# EAGLE schematic MRCS-IOX32 (EAGLE 7.3.0)
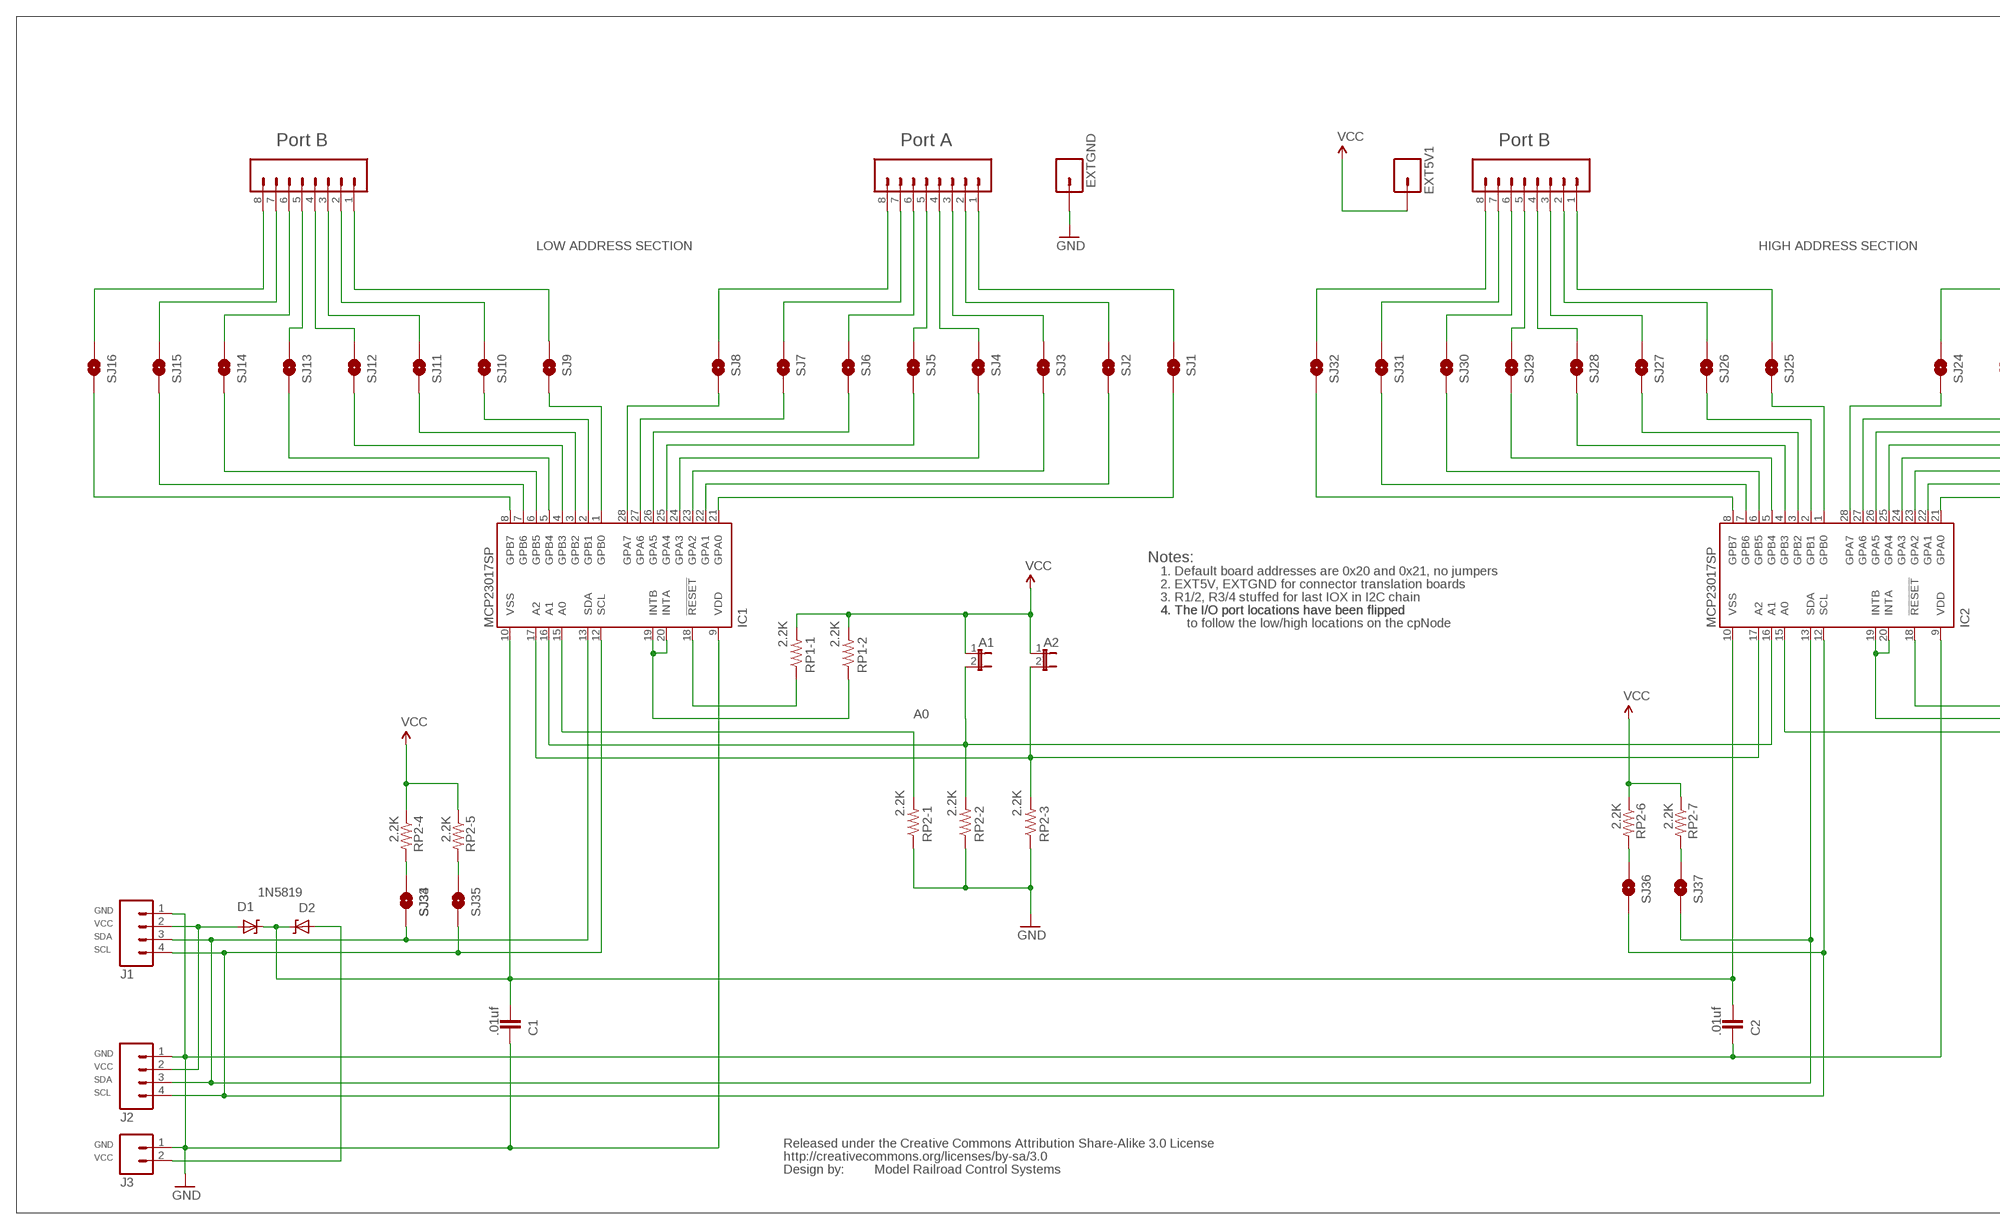
[diagram p0: schematic, sheet 1, part 1 of 2]
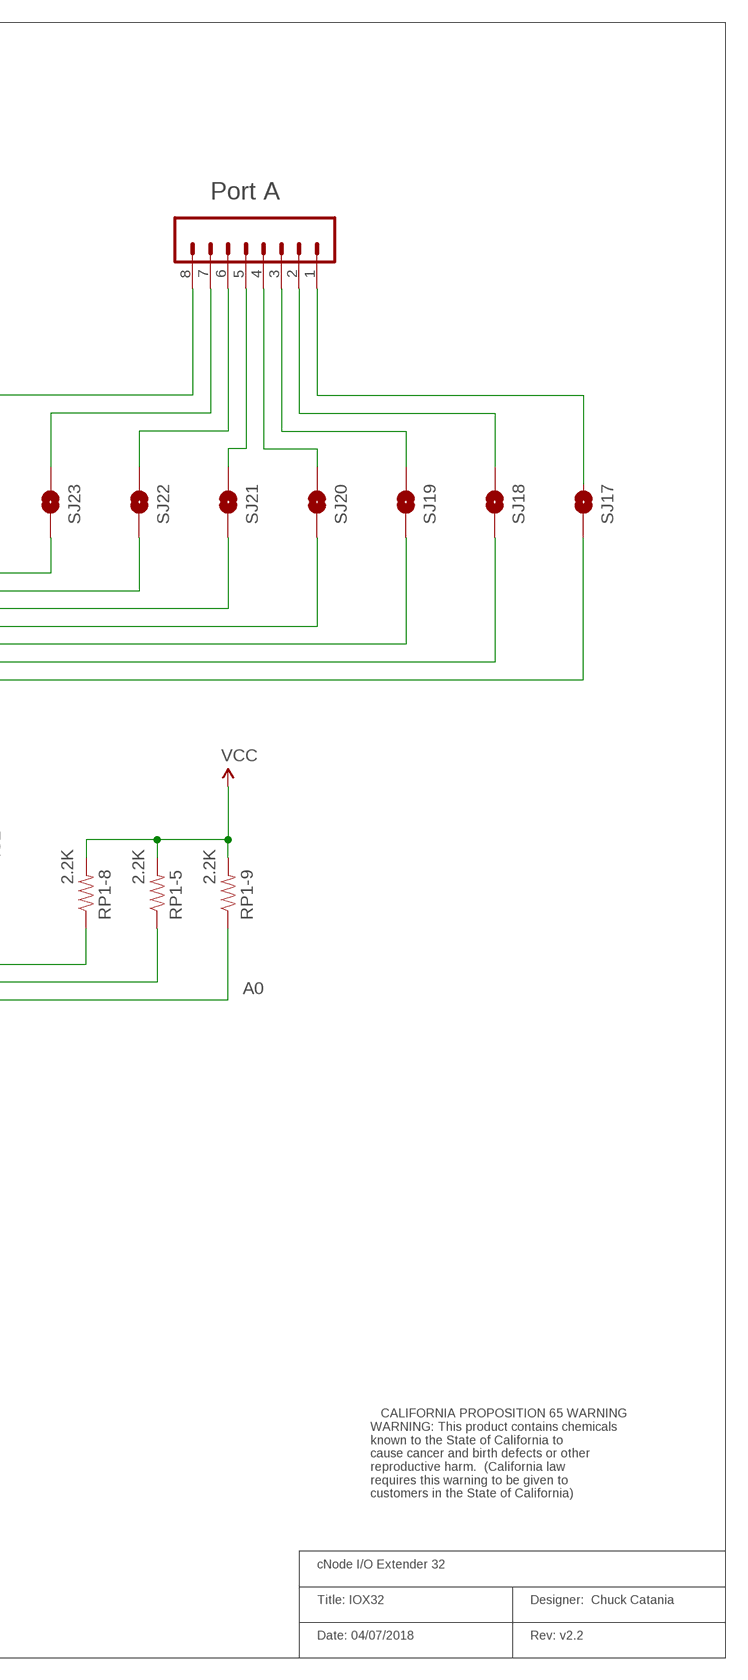
[diagram p1: schematic, sheet 1, part 2 of 2]

## Parts
A1  JUMPER-2PTH  [1X02]
A2  JUMPER-2PTH  [1X02]
C1  .01uf  CAP_  [AXIAL-5MM]
C2  .01uf  CAP_  [AXIAL-5MM]
D1  DIODE-ZENERPTH  [DIODE-ZENER]
D2  DIODE-ZENERPTH  [DIODE-ZENER]
EXT5V1  M01PTH_LONGPAD  [1X01_LONGPAD]
EXTGND  M01PTH_LONGPAD  [1X01_LONGPAD]
IC1  MCP23017SP  [DIL28-3]
IC2  MCP23017SP  [DIL28-3]
J1  M04PTH  [1X04]
J2  M04PTH  [1X04]
J3  M021X02_NO_SILK  [1X02_NO_SILK]
PORTA  M081X08  [1X08]
PORTA1  M081X08  [1X08]
PORTB  M081X08  [1X08]
PORTB1  M081X08  [1X08]
RP1-1  2.2K  RESISTORPTH-1/4W  [AXIAL-0.4]
RP1-2  2.2K  RESISTORPTH-1/4W  [AXIAL-0.4]
RP1-5  2.2K  RESISTORPTH-1/4W  [AXIAL-0.4]
RP1-8  2.2K  RESISTORPTH-1/4W  [AXIAL-0.4]
RP1-9  2.2K  RESISTORPTH-1/4W  [AXIAL-0.4]
RP2-1  2.2K  RESISTORPTH-1/4W  [AXIAL-0.4]
RP2-2  2.2K  RESISTORPTH-1/4W  [AXIAL-0.4]
RP2-3  2.2K  RESISTORPTH-1/4W  [AXIAL-0.4]
RP2-4  2.2K  RESISTORPTH-1/4W  [AXIAL-0.4]
RP2-5  2.2K  RESISTORPTH-1/4W  [AXIAL-0.4]
RP2-6  2.2K  RESISTORPTH-1/4W  [AXIAL-0.4]
RP2-7  2.2K  RESISTORPTH-1/4W  [AXIAL-0.4]
SJ1  PAD-SOLDERJUMPERNC  [2P-SMD-2X3.3]
SJ2  PAD-SOLDERJUMPERNC  [2P-SMD-2X3.3]
SJ3  PAD-SOLDERJUMPERNC  [2P-SMD-2X3.3]
SJ4  PAD-SOLDERJUMPERNC  [2P-SMD-2X3.3]
SJ5  PAD-SOLDERJUMPERNC  [2P-SMD-2X3.3]
SJ6  PAD-SOLDERJUMPERNC  [2P-SMD-2X3.3]
SJ7  PAD-SOLDERJUMPERNC  [2P-SMD-2X3.3]
SJ8  PAD-SOLDERJUMPERNC  [2P-SMD-2X3.3]
SJ9  PAD-SOLDERJUMPERNC  [2P-SMD-2X3.3]
SJ10  PAD-SOLDERJUMPERNC  [2P-SMD-2X3.3]
SJ11  PAD-SOLDERJUMPERNC  [2P-SMD-2X3.3]
SJ12  PAD-SOLDERJUMPERNC  [2P-SMD-2X3.3]
SJ13  PAD-SOLDERJUMPERNC  [2P-SMD-2X3.3]
SJ14  PAD-SOLDERJUMPERNC  [2P-SMD-2X3.3]
SJ15  PAD-SOLDERJUMPERNC  [2P-SMD-2X3.3]
SJ16  PAD-SOLDERJUMPERNC  [2P-SMD-2X3.3]
SJ17  PAD-SOLDERJUMPERNC  [2P-SMD-2X3.3]
SJ18  PAD-SOLDERJUMPERNC  [2P-SMD-2X3.3]
SJ19  PAD-SOLDERJUMPERNC  [2P-SMD-2X3.3]
SJ20  PAD-SOLDERJUMPERNC  [2P-SMD-2X3.3]
SJ21  PAD-SOLDERJUMPERNC  [2P-SMD-2X3.3]
SJ22  PAD-SOLDERJUMPERNC  [2P-SMD-2X3.3]
SJ23  PAD-SOLDERJUMPERNC  [2P-SMD-2X3.3]
SJ24  PAD-SOLDERJUMPERNC  [2P-SMD-2X3.3]
SJ25  PAD-SOLDERJUMPERNC  [2P-SMD-2X3.3]
SJ26  PAD-SOLDERJUMPERNC  [2P-SMD-2X3.3]
SJ27  PAD-SOLDERJUMPERNC  [2P-SMD-2X3.3]
SJ28  PAD-SOLDERJUMPERNC  [2P-SMD-2X3.3]
SJ29  PAD-SOLDERJUMPERNC  [2P-SMD-2X3.3]
SJ30  PAD-SOLDERJUMPERNC  [2P-SMD-2X3.3]
SJ31  PAD-SOLDERJUMPERNC  [2P-SMD-2X3.3]
SJ32  PAD-SOLDERJUMPERNC  [2P-SMD-2X3.3]
SJ33  PAD-SOLDERJUMPERNC  [2P-SMD-2X3.3]
SJ34  PAD-SOLDERJUMPERNC  [2P-SMD-2X3.3]
SJ35  PAD-SOLDERJUMPERNC  [2P-SMD-2X3.3]
SJ36  PAD-SOLDERJUMPERNC  [2P-SMD-2X3.3]
SJ37  PAD-SOLDERJUMPERNC  [2P-SMD-2X3.3]
U$1  CREATIVE_COMMONS  [CREATIVE_COMMONS]
U$2  CA-PROP65WARNING  [CA-PROP65WARNING]

## Nets
GND: C1.P$1 C2.P$1 EXTGND.1 IC1.9(VDD) IC2.9(VDD) J1.1 J2.1 J3.1 RP2-1.P$1 RP2-2.P$1 RP2-3.P$1
N$1: PORTB.8 SJ16.1
N$2: PORTB.7 SJ15.1
N$3: PORTB.6 SJ14.1
N$4: IC1.6(GPB5) SJ14.2
N$5: IC1.5(GPB4) SJ13.2
N$6: PORTB.5 SJ13.1
N$7: PORTB.4 SJ12.1
N$8: IC1.4(GPB3) SJ12.2
N$9: IC1.3(GPB2) SJ11.2
N$10: PORTB.3 SJ11.1
N$11: PORTB.2 SJ10.1
N$12: IC1.2(GPB1) SJ10.2
N$13: IC1.1(GPB0) SJ9.2
N$14: PORTB.1 SJ9.1
N$15: IC1.7(GPB6) SJ15.2
N$16: IC1.8(GPB7) SJ16.2
N$17: IC1.28(GPA7) SJ8.2
N$18: IC1.18(!RESET) RP1-1.P$1
N$19: IC1.27(GPA6) SJ7.2
N$20: C1.P$2 C2.P$2 D1.P$1(C) D2.P$1(C) IC1.10(VSS) IC2.10(VSS)
N$21: PORTA1.8 SJ24.1
N$22: PORTA1.7 SJ23.1
N$23: PORTA1.6 SJ22.1
N$24: IC1.19(INTB) IC1.20(INTA) RP1-2.P$1
N$25: PORTA1.5 SJ21.1
N$26: IC1.15(A0) RP2-1.P$2
N$27: PORTA1.4 SJ20.1
N$28: IC2.15(A0) RP1-9.P$1
N$29: PORTA1.3 SJ19.1
N$30: PORTA1.2 SJ18.1
N$31: IC1.13(SDA) IC2.13(SDA) J1.3 J2.3 SJ33.2 SJ34.2 SJ37.2
N$32: D1.P$2(A) J1.2 J2.2
N$33: PORTA1.1 SJ17.1
N$34: RP2-4.P$2 SJ33.1 SJ34.1
N$35: IC2.28(GPA7) SJ24.2
N$36: IC2.27(GPA6) SJ23.2
N$37: IC2.26(GPA5) SJ22.2
N$38: IC2.25(GPA4) SJ21.2
N$39: IC2.24(GPA3) SJ20.2
N$40: IC2.23(GPA2) SJ19.2
N$41: IC2.22(GPA1) SJ18.2
N$42: IC2.21(GPA0) SJ17.2
N$43: PORTB1.8 SJ32.1
N$44: PORTB1.7 SJ31.1
N$45: PORTB1.6 SJ30.1
N$46: IC2.6(GPB5) SJ30.2
N$47: PORTA.8 SJ8.1
N$48: PORTA.7 SJ7.1
N$49: PORTA.6 SJ6.1
N$50: PORTA.5 SJ5.1
N$51: PORTA.4 SJ4.1
N$52: PORTA.3 SJ3.1
N$53: PORTA.2 SJ2.1
N$54: PORTA.1 SJ1.1
N$55: IC1.26(GPA5) SJ6.2
N$56: IC1.25(GPA4) SJ5.2
N$57: RP2-5.P$2 SJ35.1
N$58: IC1.24(GPA3) SJ4.2
N$59: IC1.23(GPA2) SJ3.2
N$60: IC1.22(GPA1) SJ2.2
N$61: IC2.5(GPB4) SJ29.2
N$62: PORTB1.5 SJ29.1
N$63: IC1.21(GPA0) SJ1.2
N$64: PORTB1.4 SJ28.1
N$65: IC2.4(GPB3) SJ28.2
N$66: IC2.3(GPB2) SJ27.2
N$67: PORTB1.3 SJ27.1
N$68: PORTB1.2 SJ26.1
N$69: IC2.2(GPB1) SJ26.2
N$70: IC2.1(GPB0) SJ25.2
N$71: PORTB1.1 SJ25.1
N$72: D2.P$2(A) J3.2
N$73: IC2.7(GPB6) SJ31.2
N$74: IC2.8(GPB7) SJ32.2
N$75: IC1.12(SCL) IC2.12(SCL) J1.4 J2.4 SJ35.2 SJ36.2
N$76: RP2-6.P$2 SJ36.1
N$77: A1.2 IC1.16(A1) IC2.16(A1) RP2-2.P$2
N$78: A2.2 IC1.17(A2) IC2.17(A2) RP2-3.P$2
N$79: RP2-7.P$2 SJ37.1
N$84: IC2.18(!RESET) RP1-8.P$1
N$85: IC2.19(INTB) IC2.20(INTA) RP1-5.P$1
VCC: A1.1 A2.1 EXT5V1.1 RP1-1.P$2 RP1-2.P$2 RP1-5.P$2 RP1-8.P$2 RP1-9.P$2 RP2-4.P$1 RP2-5.P$1 RP2-6.P$1 RP2-7.P$1

## Notes on the sheet
- Port B | Port A | Port B | Port A
- LOW ADDRESS SECTION | HIGH ADDRESS SECTION
- Notes:
- 1. Default board addresses are 0x20 and 0x21, no jumpers
- 2. EXT5V, EXTGND for connector translation boards
- 3. R1/2, R3/4 stuffed for last IOX in I2C chain
- 4. The I/O port locations have been flipped | 4. The I/O port locations have been flipped
- to follow the low/high locations on the cpNode
- A0 | A0
- 1N5819
- 1N5819
- GND
- VCC
- SDA
- SCL
- GND
- VCC
- SDA
- SCL
- GND | cNode I/O Extender 32
- VCC
- Model Railroad Control Systems | Title: IOX32 | Designer:  Chuck Catania
- Date: 04/07/2018 | Rev: v2.2

## Library data of the parts
A1 A2 = SparkFun:JUMPER-2: Jumper Basic 0.1" spaced jumper. Use with breakaway headers.
C1 C2 = SparkFun:CAP: Capacitor Standard 0603 ceramic capacitor, and 0.1" leaded capacitor.
D1 D2 = SparkFun:DIODE-ZENER: Zener Diode Production Part - 8199 3.4V Zener Voltage
EXT5V1 EXTGND = SparkFun:M01: Header 1 Standard 1-pin 0.1" header. Use with straight break away headers (SKU : PRT-00116), right angle break away headers (PRT-00553), swiss pins (PRT-00743), machine pins (PRT-00117), and female headers (PRT-00115).
IC1 IC2 = microchip:MCP23017: http://ww1.microchip.com/downloads/en/DeviceDoc/21952a.pdf Source: http://ww1.microchip.com/downloads/en/DeviceDoc/21952a.pdf; MF: MICROCHIP; MPN: MCP23017-E/SP; OC_FARNELL: 1332088; OC_NEWARK: 31K2959
J1 J2 = SparkFun:M04: Header 4 Standard 4-pin 0.1" header. Use with straight break away headers (SKU : PRT-00116), right angle break away headers (PRT-00553), swiss pins (PRT-00743), machine pins (PRT-00117), and female headers (PRT-00115). Molex polarized connector foot print use with SKU : PRT-08231 with associated crimp pins and housings. 1MM SMD Version SKU: PRT-10208
J3 = SparkFun:M02: Header 2 Standard 2-pin 0.1" header. Use with straight break away headers (SKU : PRT-00116), right angle break away headers (PRT-00553), swiss pins (PRT-00743), machine pins (PRT-00117), and female headers (PRT-00115). Molex polarized connector foot print use with SKU : PRT-08233 with associated crimp pins and housings.
PORTA PORTA1 PORTB PORTB1 = SparkFun:M08: Header 8 Standard 8-pin 0.1" header. Use with straight break away headers (SKU : PRT-00116), right angle break away headers (PRT-00553), swiss pins (PRT-00743), machine pins (PRT-00117), and female headers (PRT-00115).
RP1-1 RP1-2 RP1-5 RP1-8 RP1-9 RP2-1-RP2-7 = SparkFun:RESISTOR: Resistor Basic schematic elements and footprints for 0603, 1206, and PTH resistors.
SJ1-SJ37 = Discreter:PAD-SOLDERJUMPER: Solder Jumper Standard SMD solder jumper. Used to automate production. Two varients : Normally Open and Normally Closed are the same, but have different paste layers. NC will have a large amount of paste and should jumper during reflow.
U$1 = SparkFun:CREATIVE_COMMONS
U$2 = MRCS-prop65warningTop:CA-PROP65WARNING: CALIFORNIA PROPOSITION 65 WARNING